# EAGLE design 5_to_12v_stepup (EAGLE 6.1)
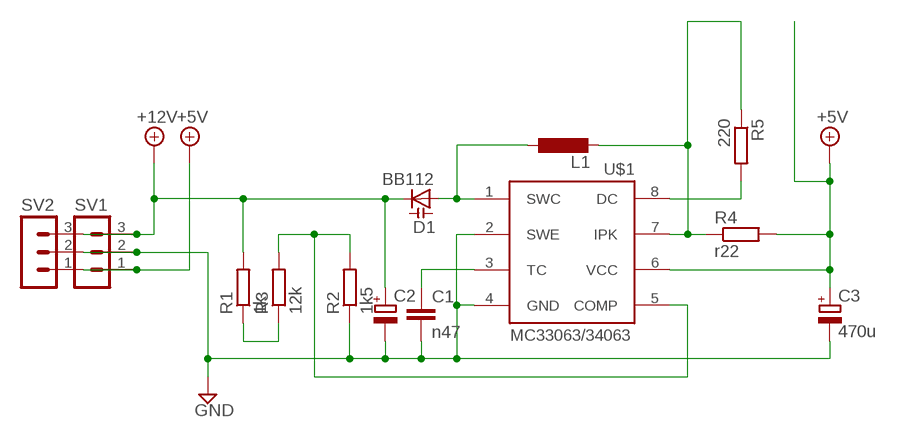
[diagram p0: schematic, sheet 1]

## Parts
C1  n47  C-EU025-025X050  [C025-025X050]
C2  CPOL-EUE3.5-8  [E3,5-8]
C3  470u  CPOL-EUE3.5-8  [E3,5-8]
D1  BB112  [SOT54H]
L1  L-EU0207/2V  [0207/2V]
R1  1k  R-EU_0207/2V  [0207/2V]
R2  1k5  R-EU_0207/2V  [0207/2V]
R3  12k  R-EU_0207/2V  [0207/2V]
R4  r22  R-EU_0207/2V  [0207/2V]
R5  220  R-EU_0207/2V  [0207/2V]
SV1  MA03-1  [MA03-1]
SV2  MA03-1  [MA03-1]
U$1  MC33063/MC34063P  [DIL08]

## Nets
+5V: C3.+ R4.2 SV1.1 SV2.1 U$1.6(VCC)
+12V: C2.+ D1.C R1.2 SV1.3 SV2.3
GND: C1.2 C2.- C3.- R2.1 SV1.2 SV2.2 U$1.2(SWE) U$1.4(GND)
N$1: R5.2 U$1.8(DC)
N$2: L1.2 R4.1 R5.1 U$1.7(IPK)
N$6: R1.1 R3.1
N$7: C1.1 U$1.3(TC)
N$8: D1.A L1.1 U$1.1(SWC)
N$9: R2.2 R3.2 U$1.5(COMP)

## Library data of the parts
C1 = rcl:C-EU: CAPACITOR, European symbol
C2 C3 = rcl:CPOL-EU: POLARIZED CAPACITOR, European symbol
D1 = diode:BB112: Capacity DIODE variable-capacitance diode
L1 = rcl:L-EU: INDUCTOR, European symbol
R1-R5 = rcl:R-EU_: RESISTOR, European symbol
SV1 SV2 = con-lstb:MA03-1: PIN HEADER; OC_FARNELL: unknown; OC_NEWARK: unknown
U$1 = adafruit_t10:MC33063/MC34063: MC33063 and MC34063 Basic DC/DC converter with internal power-NPN transistor, 100KHz, 1.5A peak switch current. 3-40 input/output.

## Board
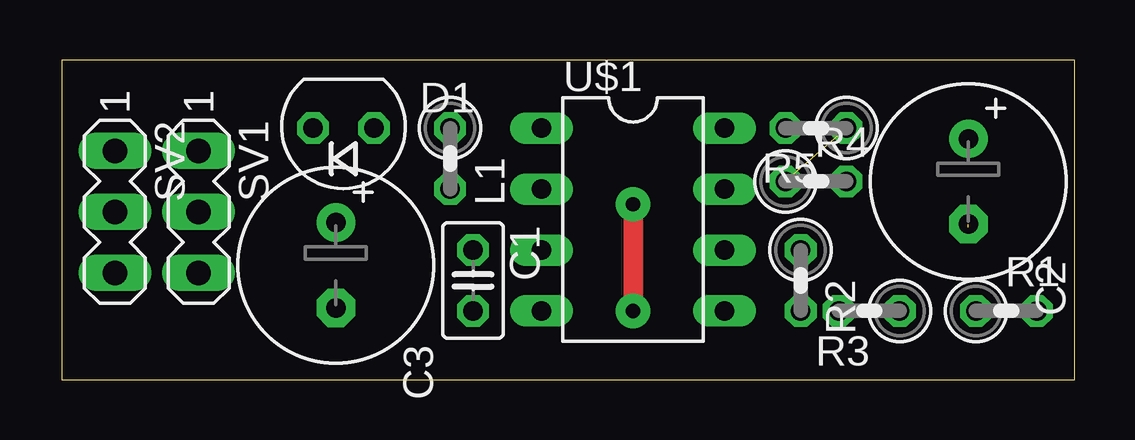
[diagram p1: board, top side]
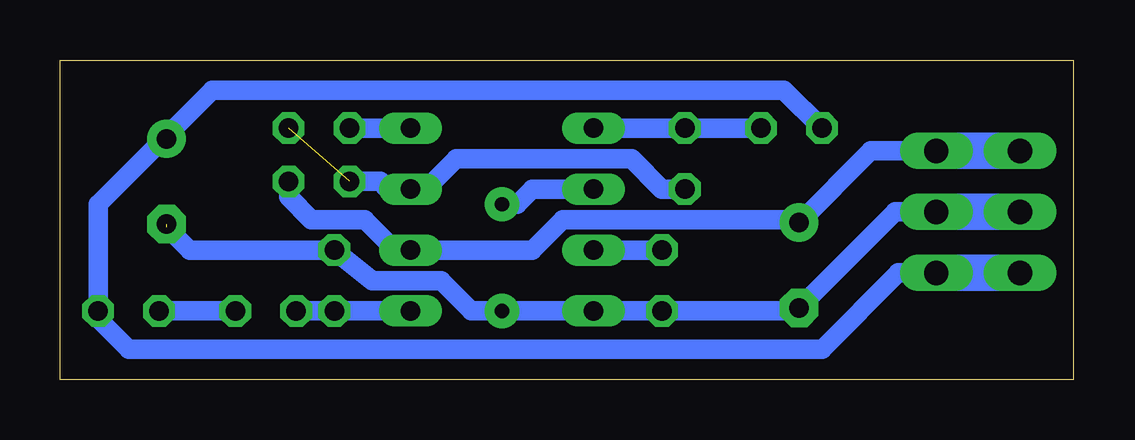
[diagram p2: board, bottom side, seen from below]

Size 42.21 x 13.31 mm. Coordinates in mm from the lower left corner, seen from the top.
Outline: 42.21,0 42.21,13.31 0,13.31 0,0 42.21,0
Copper layers (1*16): Top 0.035mm / dielectric 1.5mm / Bottom 0.035mm
Design rules: minimum track width 10mil, minimum drill 24mil, track to track 8mil, track to pad 8mil, pad to pad 8mil, via to via 8mil, smd to smd 8mil, copper to edge 40mil, drill to drill 8mil, minimum pad ring 10mil, minimum via ring 8mil, stop-mask expansion 4mil, vias tented up to drill 0mil, thermal gap 10mil

### Footprints (pad centres in the part's own frame; a part is rotated, then mirrored left to right if it is on the bottom)
C025-025X050 = drill 0.813 octagon: 1 -1.27,0; 2 1.27,0
E3,5-8 = drill 0.813 pad 1.6: + -1.778,0 | drill 0.813 pad 1.6 octagon: - 1.778,0
SOT54H = drill 0.813 octagon: A 1.27,0; C -1.27,0
0207/2V = drill 0.813 octagon: 1 -1.27,0; 2 1.27,0
MA03-1 = drill 1.016 long: 1 -2.54,0; 2 0,0; 3 2.54,0
DIL08 = drill 0.813 long: 1 -3.81,-3.81; 2 -1.27,-3.81; 3 1.27,-3.81; 4 3.81,-3.81; 5 3.81,3.81; 6 1.27,3.81; 7 -1.27,3.81; 8 -3.81,3.81

### Placement (x,y rotation side)
C1  17.13,4.13 270 top
C2  37.77,8.26 270 top
C3  11.42,4.76 270 top
D1  11.74,10.48 0 top
L1  16.18,9.21 270 top
R1  39.36,2.86 0 top
R2  30.79,4.13 270 top
R3  33.64,2.86 180 top
R4  31.42,8.26 0 top
R5  31.42,10.48 180 top
SV1  5.7,6.99 270 top
SV2  2.21,6.99 270 top
U$1  23.8,6.67 270 top

### Tracks (layer width: path | path; a pad name or v marks a point on that pad's centre or on a via)
+5V
  Bottom 0.813: SV1.1 8.43,9.53 C3.+ 11.61,6.67 21.26,6.67 22.53,5.4 U$1.6 28.25,5.4 29.51,6.67 31.74,6.67 32.69,7.62 R4.2
  Bottom 1.524: SV2.1 SV1.1
+12V
  Bottom 0.813: SV1.3 7.29,4.45 10.46,1.27 39.36,1.27 40.63,2.54 R1.2 40.63,7.3 37.77,10.16 | D1.C 12.05,12.06 35.86,12.06 37.77,10.16 | C2.+ 37.77,10.16
  Bottom 1.524: SV2.3 SV1.3
GND  (via drill 0.6 pad 1.42)  (1 unrouted)
  Top 0.813: v23.8,7.3 v23.8,2.86
  Bottom 0.813: SV1.2 7.42,6.99 C3.- 11.86,2.86 C1.2 U$1.4 v23.8,2.86 25.07,2.86 26.34,4.13 29.2,4.13 R2.1 36.82,5.4 37.77,6.35 37.77,6.67 | U$1.2 22.53,7.94 23.16,7.3 v23.8,7.3
  Bottom 1.524: SV2.2 SV1.2
N$1
  Bottom 0.813: R5.2 U$1.8
N$2  (1 unrouted)
  Bottom 0.813: L1.2 17.13,7.94 18.4,9.21 25.71,9.21 26.98,7.94 U$1.7 28.56,7.94 28.88,8.26 R4.1
N$6
  Bottom 0.813: R1.1 R3.1
N$7
  Bottom 0.813: C1.1 U$1.3
N$8
  Bottom 0.813: U$1.1 L1.1 D1.A
N$9
  Bottom 0.813: U$1.5 R2.2 R3.2